# EAGLE schematic LegoConnectorX1B (EAGLE 9.0.1)
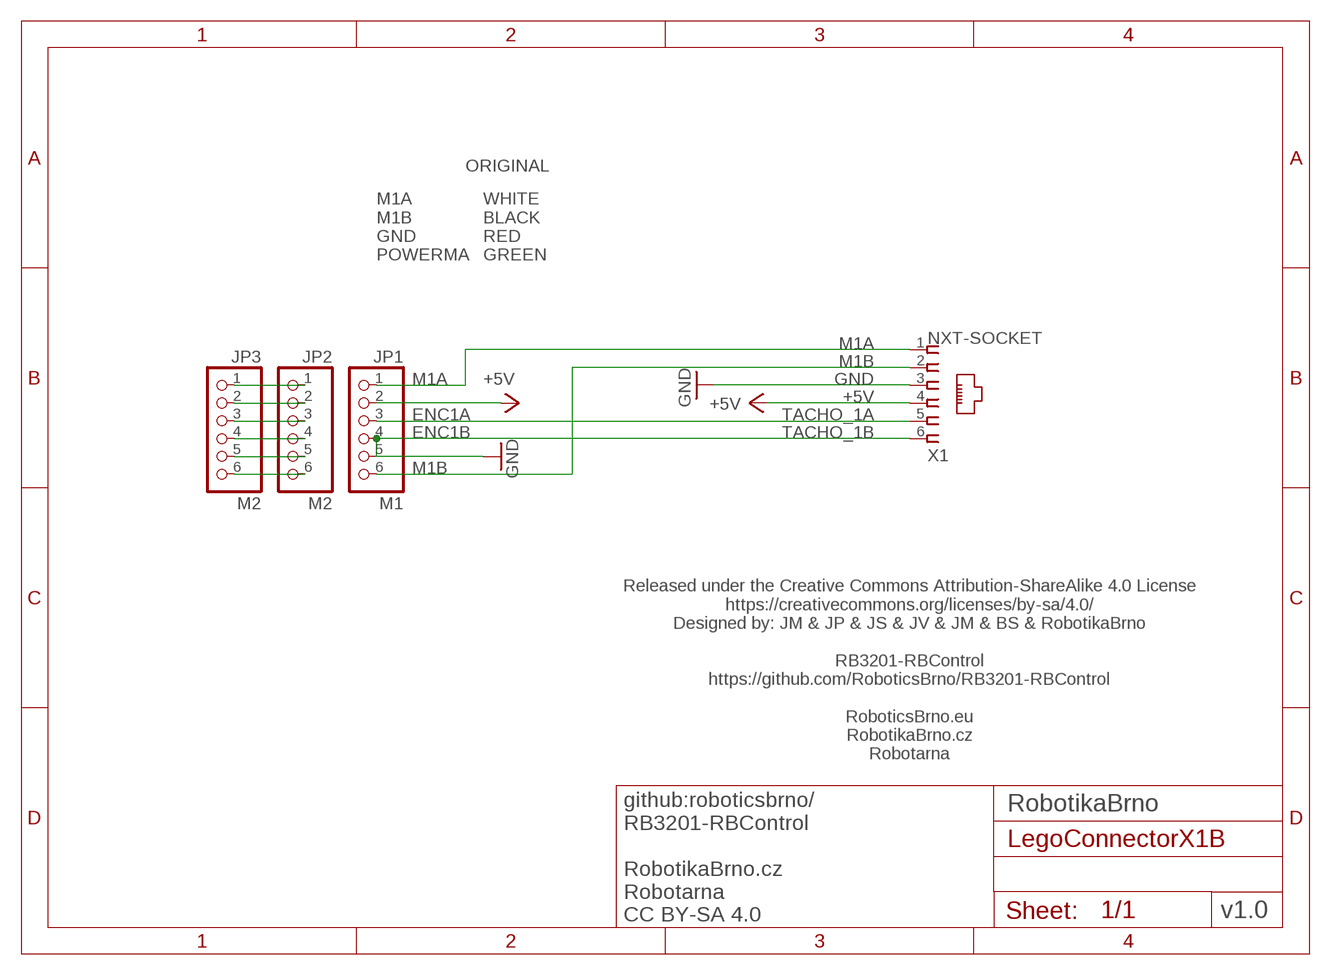
[diagram p0: schematic, sheet 1]

## Parts
JP1  M1  PINHD-1X6  [1X06]
JP2  M2  PINHD-1X6  [1X06]
JP3  M2  PINHD-1X6  [1X06]
X1  NXT-SOCKET  [NXT-SOCKET]

## Nets
+5V: JP1.2 X1.4
GND: JP1.5 X1.3
M1A: JP1.1 X1.1
M1B: JP1.6 X1.2
N$1: JP2.1 JP3.1
N$2: JP2.2 JP3.2
N$3: JP2.3 JP3.3
N$4: JP2.4 JP3.4
N$5: JP2.5 JP3.5
N$6: JP2.6 JP3.6
TACHO_1A: JP1.3 X1.5
TACHO_1B: JP1.4 X1.6

## Notes on the sheet
- ORIGINAL
- M1A
  M1B
  GND
  POWERMA
- WHITE
  BLACK
  RED
  GREEN
- ENC1A
- ENC1B
- Released under the Creative Commons Attribution-ShareAlike 4.0 License
  https://creativecommons.org/licenses/by-sa/4.0/
  Designed by: JM & JP & JS & JV & JM & BS & RobotikaBrno
  
  RB3201-RBControl
  https://github.com/RoboticsBrno/RB3201-RBControl
  
  RoboticsBrno.eu
  RobotikaBrno.cz
  Robotarna
- RobotikaBrno
- v1.0
- github:roboticsbrno/
  RB3201-RBControl
  
  RobotikaBrno.cz
  Robotarna
  CC BY-SA 4.0

## Library data of the parts
JP1-JP3 = pinhead:PINHD-1X6: PIN HEADER
X1 = NXT Compatible (female) Sockets - Mindsensors:NXT-SOCKET: RJ11 6 connects Manufacturer: Mindsensors.com Source: NXT-Female-Socket.pdf; OC_FARNELL: unknown; OC_NEWARK: unknown

## Net classes
0 default: width 0.2 mm, drill 0.35 mm, clearance 0.2 mm